# EAGLE design ultrasonic_send (EAGLE 6.5.0)
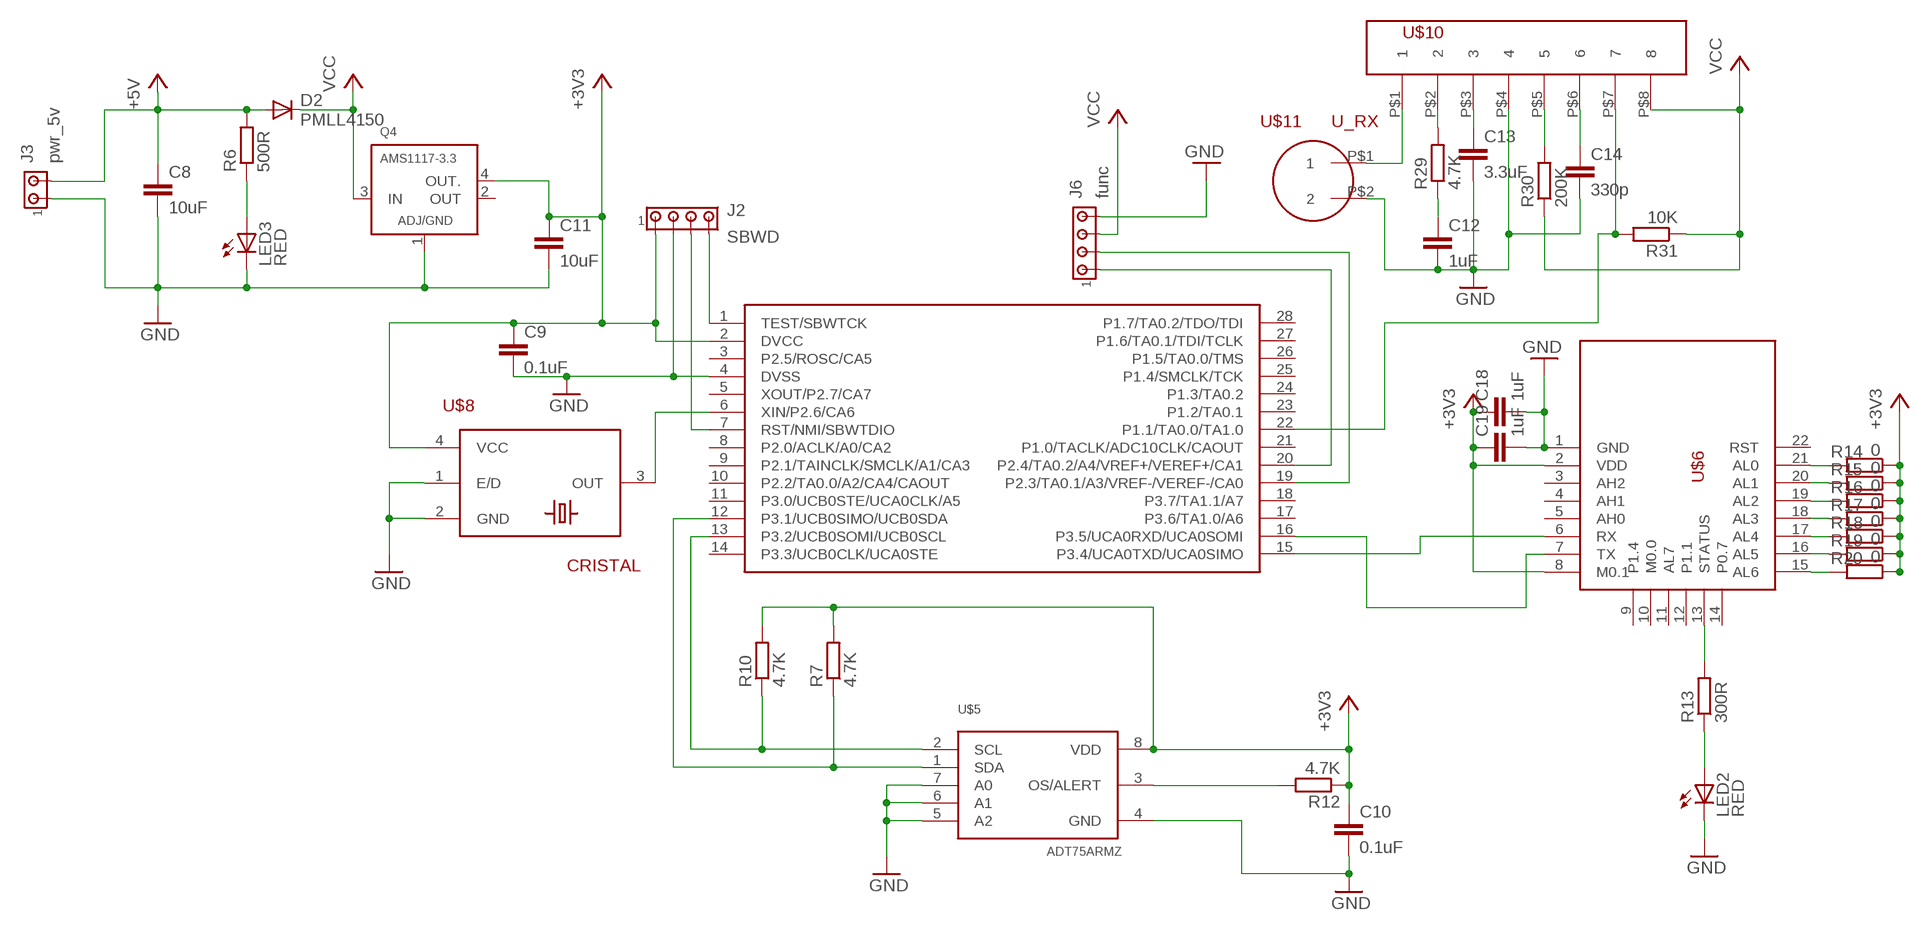
[diagram p0: schematic, sheet 1]

## Parts
C8  10uF  C-EUC0805  [C0805]
C9  0.1uF  C-EUC0805  [C0805]
C10  0.1uF  C-EUC0805  [C0805]
C11  10uF  C-EUC0805  [C0805]
C12  1uF  C-EUC0805  [C0805]
C13  3.3uF  C-EUC0805  [C0805]
C14  330p  C-EUC0805  [C0805]
C18  1uF  C-EUC0805  [C0805]
C19  1uF  C-EUC0805  [C0805]
D2  PMLL4150  [SOD80C]
J2  SBWD  MTA04-100  [10X04MTA]
J3  pwr_5v  MTA02-100  [10X02MTA]
J6  func  MTA04-100  [10X04MTA]
LED2  RED  LEDCHIP-LED0805  [CHIP-LED0805]
LED3  RED  LEDCHIP-LED0805  [CHIP-LED0805]
Q4  AMS1117-3.3  TLV1117  [SOT223-4]
R6  500R  R-EU_R0603  [R0603]
R7  4.7K  R-EU_R0603  [R0603]
R10  4.7K  R-EU_R0603  [R0603]
R12  4.7K  R-EU_R0603  [R0603]
R13  300R  R-EU_R0603  [R0603]
R14  0  R-EU_R0603  [R0603]
R15  0  R-EU_R0603  [R0603]
R16  0  R-EU_R0603  [R0603]
R17  0  R-EU_R0603  [R0603]
R18  0  R-EU_R0603  [R0603]
R19  0  R-EU_R0603  [R0603]
R20  0  R-EU_R0603  [R0603]
R29  4.7K  R-EU_R0603  [R0603]
R30  200K  R-EU_R0603  [R0603]
R31  10K  R-EU_R0603  [R0603]
U$4  MSP430F2112  [PW_R-PDSO-G28]
U$5  ADT75ARMZ  [MSOP08]
U$6  ZIGBEE  [ZIGBEE]
U$8  CRISTAL  [CTS406]
U$10  CX20106  [CX20106]
U$11  U_RX  ULTRASONIC  [ULTRASONIC]

## Nets
+3V3: C9.1 C10.1 C11.1 C18.1 C19.1 J2.1 Q4.4(OUT.) R7.2 R10.2 R12.1 R14.1 R15.1 R16.1 R17.1 R18.1 R19.1 R20.1 U$4.2(DVCC) U$5.8(VDD) U$6.2(VDD) U$6.8(M0.1) U$8.4(VCC)
+5V: C8.1 D2.A J3.2 R6.2
GND: C8.2 C9.2 C10.2 C11.2 C12.2 C13.2 C14.2 C18.2 C19.2 J2.2 J3.1 J6.4 LED2.C LED3.C Q4.1(ADJ/GND) U$4.4(DVSS) U$5.4(GND) U$5.5(A2) U$5.6(A1) U$5.7(A0) U$6.1(GND) U$8.1(E/D) U$8.2(GND) U$10.P$4 U$11.P$2
N$11: J2.4 U$4.1(TEST/SBWTCK)
N$12: J2.3 U$4.7(RST/NMI/SBWTDIO)
N$13: LED3.A R6.1
N$14: R12.2 U$5.3(OS/ALERT)
N$15: R7.1 U$4.12(P3.1/UCB0SIMO/UCB0SDA) U$5.1(SDA)
N$16: R10.1 U$4.13(P3.2/UCB0SOMI/UCB0SCL) U$5.2(SCL)
N$17: U$4.6(XIN/P2.6/CA6) U$8.3(OUT)
N$19: U$4.16(P3.5/UCA0RXD/UCA0SOMI) U$6.7(TX)
N$20: U$4.15(P3.4/UCA0TXD/UCA0SIMO) U$6.6(RX)
N$21: LED2.A R13.1
N$22: R13.2 U$6.13(STATUS)
N$23: R14.2 U$6.21(AL0)
N$24: R15.2 U$6.20(AL1)
N$25: R16.2 U$6.19(AL2)
N$26: R17.2 U$6.18(AL3)
N$27: R18.2 U$6.17(AL4)
N$28: R19.2 U$6.16(AL5)
N$29: R20.2 U$6.15(AL6)
N$47: R29.2 U$10.P$2
N$48: C12.1 R29.1
N$49: U$10.P$1 U$11.P$1
N$50: C13.1 U$10.P$3
N$51: R31.2 U$4.22(P1.1/TA0.0/TA1.0) U$10.P$7
N$52: R30.2 U$10.P$5
N$53: C14.1 U$10.P$6
N$57: J6.1 U$4.20(P2.4/TA0.2/A4/VREF+/VEREF+/CA1)
N$58: J6.2 U$4.19(P2.3/TA0.1/A3/VREF-/VEREF-/CA0)
VCC: D2.C J6.3 Q4.3(IN) R30.1 R31.1 U$10.P$8
Unconnected: U$4.3(P2.5/ROSC/CA5) U$4.5(XOUT/P2.7/CA7) U$4.8(P2.0/ACLK/A0/CA2) U$4.9(P2.1/TAINCLK/SMCLK/A1/CA3) U$4.10(P2.2/TA0.0/A2/CA4/CAOUT) U$4.11(P3.0/UCB0STE/UCA0CLK/A5) U$4.14(P3.3/UCB0CLK/UCA0STE) U$4.17(P3.6/TA1.0/A6) U$4.18(P3.7/TA1.1/A7) U$4.21(P1.0/TACLK/ADC10CLK/CAOUT) U$4.23(P1.2/TA0.1) U$4.24(P1.3/TA0.2) U$4.25(P1.4/SMCLK/TCK) U$4.26(P1.5/TA0.0/TMS) U$4.27(P1.6/TA0.1/TDI/TCLK) U$4.28(P1.7/TA0.2/TDO/TDI) U$6.3(AH2) U$6.4(AH1) U$6.5(AH0) U$6.9(P1.4) U$6.10(M0.0) U$6.11(AL7) U$6.12(P1.1) U$6.14(P0.7) U$6.22(RST)

## Power pins joined to a net without a drawn wire
OUT: Q4.2(OUT)

## Library data of the parts
C8-C14 C18 C19 = resistor:C-EU: CAPACITOR, European symbol
D2 = diode:PMLL4150: DIODE high speed
J2 J6 = con-amp:MTA04-100: AMP connector
J3 = con-amp:MTA02-100: AMP connector
LED2 LED3 = led:LED: LED OSRAM: - CHIPLED LG R971, LG N971, LY N971, LG Q971, LY Q971, LO R971, LY R971 LH N974, LH R974 LS Q976, LO Q976, LY Q976 LO Q996 - Hyper CHIPLED LW Q18S LB Q993, LB Q99A, LB R99A - SideLED LS A670, LO A670, LY A670, LG A670, LP A670 LB A673, LV A673, LT A673, LW A673 LH A674 LY A675 LS A676, LA A676, LO A676, LY A676, LW A676 LS A679, LY A679, LG A679 - Hyper Micro SIDELED® LS Y876, LA Y876, LO Y876, LY Y876 LT Y87S - SmartLED LW L88C, LW L88S LB L89C, LB L89S, LG L890 LS L89K, LO L89K, LY L89K LS L896, LA L896, LO L896, LY L896 - TOPLED LS T670, LO T670, LY T670, LG T670, LP T670 LSG T670, LSP T670, LSY T670, LOP T670, LYG T670 LG T671, LOG T671, LSG T671 LB T673, LV T673, LT T673, LW T673 LH T674 LS T676, LA T676, LO T676, LY T676, LB T676, LH T676, LSB T676, LW T676 LB T67C, LV T67C, LT T67C, LS T67K, LO T67K, LY T67K, LW E67C LS E67B, LA E67B, LO E67B, LY E67B, LB E67C, LV E67C, LT E67C LW T67C LS T679, LY T679, LG T679 LS T770, LO T770, LY T770, LG T770, LP T770 LB T773, LV T773, LT T773, LW T773 LH T774 LS E675, LA E675, LY E675, LS T675 LS T776, LA T776, LO T776, LY T776, LB T776 LHGB T686 LT T68C, LB T68C - Hyper Mini TOPLED® LB M676 - Mini TOPLED Santana® LG M470 LS M47K, LO M47K, LY M47K Source: http://www.osram.convergy.de LUXEON: - LUMILED® LXK2-PW12-R00, LXK2-PW12-S00, LXK2-PW14-U00, LXK2-PW14-V00 LXK2-PM12-R00, LXK2-PM12-S00, LXK2-PM14-U00 LXK2-PE12-Q00, LXK2-PE12-R00, LXK2-PE12-S00, LXK2-PE14-T00, LXK2-PE14-U00 LXK2-PB12-K00, LXK2-PB12-L00, LXK2-PB12-M00, LXK2-PB14-N00, LXK2-PB14-P00, LXK2-PB14-Q00 LXK2-PR12-L00, LXK2-PR12-M00, LXK2-PR14-Q00, LXK2-PR14-R00 LXK2-PD12-Q00, LXK2-PD12-R00, LXK2-PD12-S00 LXK2-PH12-R00, LXK2-PH12-S00 LXK2-PL12-P00, LXK2-PL12-Q00, LXK2-PL12-R00 Source: www.luxeon.com KINGBRIGHT: KA-3528ASYC Source: www.kingbright.com
Q4 = ti-parts:TLV1117: LDO VOLTAGE REGULATOR
R6 R7 R10 R12-R20 R29-R31 = resistor:R-EU_: RESISTOR, European symbol
U$4 = tofu:MSP430F2112
U$5 = tofu:ADT75ARMZ: ±1°C Accurate, 12-Bit Digital Temperature Sensor
U$6 = tofu:ZIGBEE
U$8 = tofu:CRISTAL
U$10 = tofu:CX20106
U$11 = tofu:ULTRASONIC

## Board
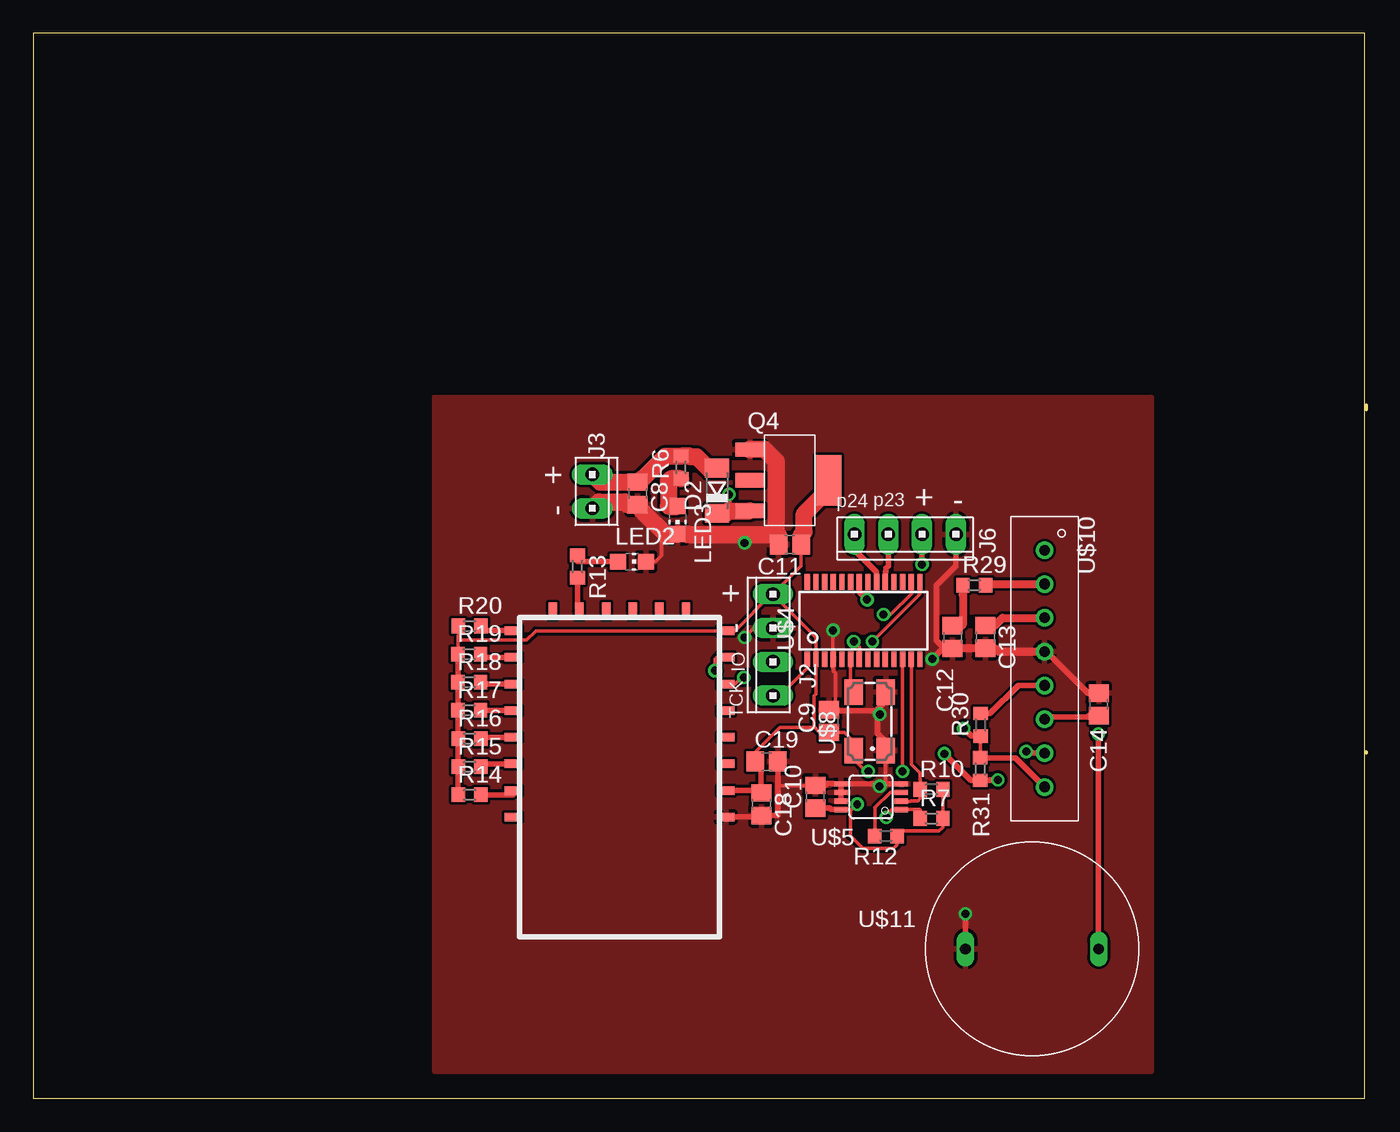
[diagram p1: board, top side]
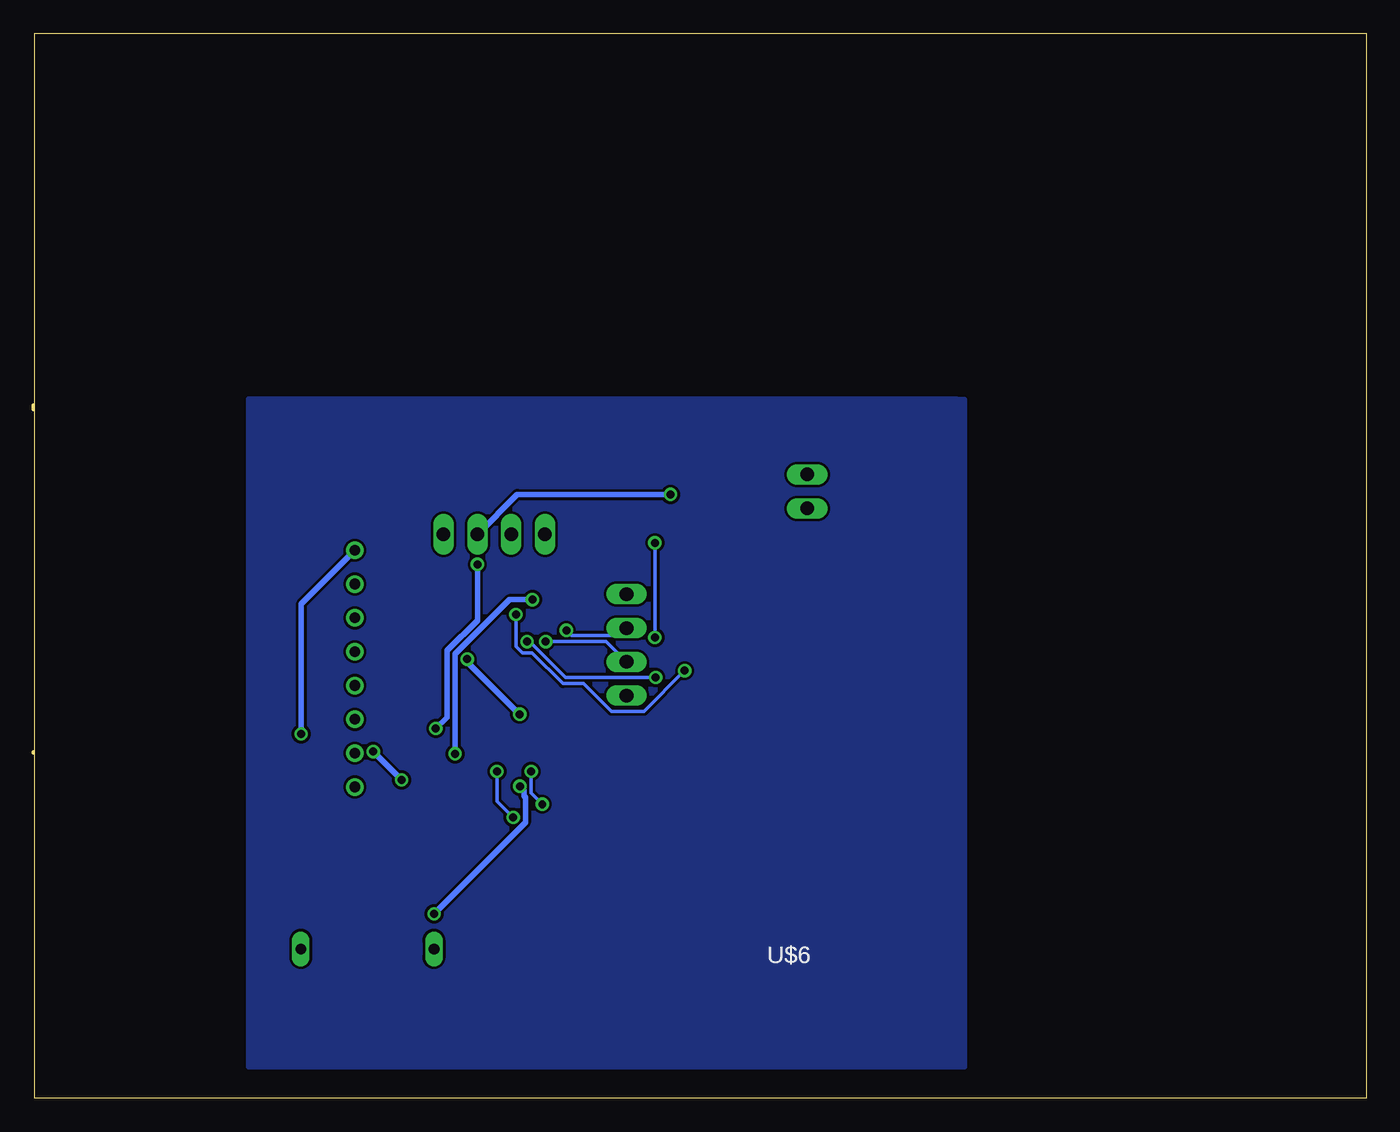
[diagram p2: board, bottom side, seen from below]

Size 100.1 x 80 mm. Coordinates in mm from the lower left corner, seen from the top.
Outline: 100.1,26.04 100.1,25.93
Outline: 100.1,51.74 100.1,52.07
Outline: 0,0 100,0 100,80 0,80 0,0
Copper layers (1*16): Top 0.035mm / dielectric 1.5mm / Bottom 0.035mm
Design rules "default *": minimum track width 10mil, minimum drill 10mil, track to track 8mil, track to pad 8mil, pad to pad 8mil, via to via 8mil, smd to smd 8mil, copper to edge 40mil, drill to drill 8mil, minimum pad ring 10mil, minimum via ring 8mil, stop-mask expansion 4mil, vias tented up to drill 0.7mm, thermal gap 10mil

### Footprints (pad centres in the part's own frame; a part is rotated, then mirrored left to right if it is on the bottom)
C0805 = smd 1.3 x 1.5: 1 -0.85,0; 2 0.85,0
SOD80C = smd 1.4 x 1.8: A 1.7,0; C -1.7,0
10X04MTA = drill 1.016 long: 1 3.81,0; 2 1.27,0; 3 -1.27,0; 4 -3.81,0
10X02MTA = drill 1.016 long: 1 1.27,0; 2 -1.27,0
CHIP-LED0805 = smd 1.2 x 1.2: A 0,-1.05; C 0,1.05
SOT223-4 = smd 1.067 x 2.184: 1 -2.3,-3; 2 0,-3; 3 2.3,-3 | smd 3.81 x 1.93: 4 0,2.9
R0603 = smd 1 x 1.1: 1 -0.85,0; 2 0.85,0
PW_R-PDSO-G28 = smd 0.4 x 1.2: 1 -4.225,-2.9; 2 -3.575,-2.9; 3 -2.925,-2.9; 4 -2.275,-2.9; 5 -1.625,-2.9; 6 -0.975,-2.9; 7 -0.325,-2.9; 8 0.325,-2.9; 9 0.975,-2.9; 10 1.625,-2.9; 11 2.275,-2.9; 12 2.925,-2.9; 13 3.575,-2.9; 14 4.225,-2.9; 15 4.225,2.9; 16 3.575,2.9; 17 2.925,2.9; 18 2.275,2.9; 19 1.625,2.9; 20 0.975,2.9; 21 0.325,2.9; 22 -0.325,2.9; 23 -0.975,2.9; 24 -1.625,2.9; 25 -2.275,2.9; 26 -2.925,2.9; 27 -3.575,2.9; 28 -4.225,2.9
MSOP08 = smd 0.4 x 1: 1 -0.976,-2.263; 2 -0.326,-2.263; 3 0.324,-2.263; 4 0.974,-2.263; 5 0.974,2.262; 6 0.324,2.262; 7 -0.326,2.262; 8 -0.976,2.262
ZIGBEE = smd 0.635 x 1.27: 1 3,8; 2 1,8; 3 -1,8; 4 -3,8; 5 -5,8; 6 -7,8; 7 -9,8; 8 -11,8; 15 -11,-8; 16 -9,-8; 17 -7,-8; 18 -5,-8; 19 -3,-8; 20 -1,-8; 21 1,-8; 22 3,-8 | smd 1.27 x 0.635: 9 -12.5,5; 10 -12.5,3; 11 -12.5,1; 12 -12.5,-1; 13 -12.5,-3; 14 -12.5,-5
CTS406 = smd 1.9 x 1.4: 1 -2.2,-1.2; 2 2.2,-1.2; 3 2.2,1.2; 4 -2.2,1.2
CX20106 = drill 0.8: P$1 -10.16,0; P$2 -7.62,0; P$3 -5.08,0; P$4 -2.54,0; P$5 0,0; P$6 2.54,0; P$7 5.08,0; P$8 7.62,0
ULTRASONIC = drill 0.8 long: P$1 -5,0; P$2 5,0

### Placement (x,y rotation side)
C8  45.39,45.44 270 top
C9  59.77,28.35 90 top
C10  58.72,22.66 90 top
C11  56.82,41.61 180 top
C12  69.04,34.65 270 top
C13  71.5,34.67 270 top
C14  80.01,29.59 90 top
C18  54.69,22.1 270 top
C19  55.07,25.3 0 top
D2  51.33,45.64 90 top
J2  55.55,34.06 90 top
J3  41.99,45.59 270 top
J6  65.48,42.37 180 top
LED2  44.96,40.31 270 top
LED3  48.39,43.43 180 top
Q4  56.82,46.43 270 top
R6  48.64,47.4 90 top
R7  67.46,21.03 0 top
R10  67.46,23.22 0 top
R12  64.03,19.71 180 top
R13  40.87,39.95 270 top
R14  32.77,22.81 0 top
R15  32.77,24.92 0 top
R16  32.77,27.03 0 top
R17  32.74,29.16 0 top
R18  32.74,31.27 0 top
R19  32.74,33.38 0 top
R20  32.77,35.48 0 top
R29  70.66,38.56 0 top
R30  71.15,28.07 90 top
R31  71.12,24.74 270 top
U$4  62.36,35.89 0 top
U$5  62.92,22.66 90 top
U$6  44.02,24.13 270 top
U$8  62.81,28.32 90 top
U$10  75.95,31.01 270 top
U$11  75.01,11.23 180 top

### Tracks (layer width: path | path; a pad name or v marks a point on that pad's centre or on a via)
+3V3  (via drill 0.6)
  Top 0.254: 58.62,27.94 58.62,30.23 58.78,30.38 58.78,32.97 U$4.2 58.78,33.12 58.78,34.62 55.63,37.77 J2.1 | 58.62,27.94 59.05,27.51 59.66,27.51 C9.1 59.89,27.51 60.48,27.51 60.5,27.48 60.91,27.48 61.62,26.77 61.62,26.14 U$8.4 61.62,26.01 61.62,25.48 62.53,24.56 v62.71,24.56 | R10.2 68.3,21.13 R7.2 68.3,20.37 68.02,20.09 64.87,20.09 R12.1 64.87,19.61 64.87,19.05 64.59,18.77 62.31,18.77 61.37,19.71 61.37,21.67 | 58.62,27.94 58.52,27.86 56.08,27.86 54.23,26.01 54.23,25.48 C19.1 | 61.37,21.67 61.34,21.69 60.83,21.69 U$5.8 | v61.87,22.1 61.47,21.69 61.37,21.67 | 31.9,34.42 31.9,34.75 31.93,34.77 R20.1 | 31.9,34.42 31.9,33.55 R19.1 | 31.9,34.42 37.03,34.42 37.74,35.13 51.99,35.13 U$6.8 52.12,35.13 52.7,35.13 55.45,37.87 J2.1 | C11.1 57.66,41 57.66,40.01 55.63,37.97 J2.1
  Top 0.406: R19.1 R18.1 R17.1 31.89,27.03 R16.1 R15.1 R14.1 | C18.1 54.69,23.11 54.63,23.11 54.63,23.13 | 54.63,23.13 U$6.2 | 54.63,23.13 54.63,25.3 C19.1 | C10.1 59.78,21.81 59.89,21.69 60.64,21.69 U$5.8
  Top 1.27: C11.1 57.66,41.6 57.66,42.32 57.89,42.55 57.89,43.89 59.72,45.72 Q4.4
  Bottom 0.254: v62.71,24.56 62.71,22.94 v61.87,22.1
+5V
  Top 1.27: J3.2 42.57,46.28 C8.1 45.9,46.66 47.47,48.23 48.64,48.23 | 48.64,48.23 R6.2 | D2.A 50.67,47.35 49.81,48.21 49.38,48.21 49.35,48.23 48.64,48.23
GND  (via drill 0.6)
  Top 0.254: C9.2 59.77,29.18 60.22,29.18 60.22,31.95 60.1,32.08 60.1,32.26 60.07,32.28 60.07,32.97 U$4.4 60.07,33.1 v60.07,35.15 | 63.98,23.63 63.98,25.4 64.01,25.43 64.01,26.01 U$8.1 | 55.92,23.47 57.99,23.47 58.01,23.5 58.55,23.5 C10.2 | J2.2 54.13,35.33 v53.42,34.62 | v53.42,41.73 53.42,42.34 | LED2.C 46.71,40.31 47.17,40.77 47.17,41.83 47.47,42.39
  Top 0.406: C19.2 55.92,23.47 55.92,21.25 C18.2 54.69,21.13 U$6.1 | U$5.5 60.63,23.62 60.07,23.62 60.05,23.65 59.59,23.65 59.44,23.5 58.73,23.5 C10.2 | U$5.5 U$5.6 U$5.7 | U$5.5 63.55,23.63 | 63.55,23.63 63.98,23.63 U$5.4 | 63.3,29.11 64.01,29.82 64.01,30.48 63.93,30.56 63.93,31.06 63.98,31.11 64.01,31.11 U$8.2 | 63.3,29.11 60.48,29.11 60.4,29.18 60.33,29.18 C9.2 | 63.4,28.85 63.4,27.43 64.01,26.82 64.01,26.24 U$8.1 | 63.4,28.85 63.4,28.93 63.3,29.11 | 68.33,33.81 68.76,33.81 C12.2 | v67.51,32.99 68.33,33.81 | v63.58,28.85 63.4,28.85 | J6.4 69.29,40.01 67.82,38.53 67.82,34.39 68.22,33.98 68.33,33.81 | C14.2 80.01,30.43 79.22,30.43 76.22,33.43 U$10.P$4 | v70,13.87 U$11.P$2 | v63.55,23.44 63.55,23.63
  Top 0.61: C12.2 69.75,33.81 69.77,33.83 71.5,33.83 C13.2 71.78,33.83 72.21,33.83 72.49,33.55 U$10.P$4
  Top 1.27: J3.1 42.47,44.81 44.45,44.81 44.65,44.6 45.39,44.6 C8.2 45.77,44.09 47.47,42.39 48.39,42.39 | 48.39,42.39 LED3.C | 55.8,42.34 53.42,42.34 49.15,42.34 49.1,42.39 48.39,42.39 | 55.8,42.34 55.91,42.34 55.98,42.27 55.98,41.6 C11.2 | 55.8,42.34 55.8,47.85 54.91,48.74 53.82,48.74 Q4.1
  Bottom 0.254: v53.42,41.73 v53.42,34.62 | v60.07,35.15 59.69,34.77 56.11,34.77 J2.2
  Bottom 0.406: v67.51,32.99 67.51,32.79 v63.58,28.85 | v70,13.87 63.14,20.73 63.14,22.61 63.25,22.71 63.25,23.14 v63.55,23.44
  pour Top: 30.2,52.65 83.95,52.65 83.95,2.06 30.15,2.06 30.15,52.68
N$1
  pour Bottom: 30.76,52.53 83.92,52.53 83.92,2.39 30.18,2.39 30.18,52.5
N$11
  Top 0.254: J2.4 56.06,30.25 58.14,32.33 58.14,32.97 U$4.1
N$12  (via drill 0.6)
  Top 0.254: v61.62,34.31 62.03,33.91 U$4.7
  Bottom 0.254: v61.62,34.31 57.07,34.31 J2.3
N$13
  Top 1.27: LED3.A 47.73,44.48 47.7,44.5 47.7,46.35 47.9,46.56 R6.1
N$14
  Top 0.254: U$5.3 64.36,22.99 63.22,21.84 63.22,20.45 63.2,20.42 63.2,19.71 R12.2
N$15  (via drill 0.6)
  Top 0.254: R7.1 66.62,21.03 66.62,21.67 66.6,21.69 65.2,21.69 U$5.1 65.05,21.69 64.49,21.69 64.06,21.26 v64.06,21.11 | v65.28,24.56 65.28,32.97 U$4.12
  Bottom 0.254: v65.28,24.56 65.28,22.33 v64.06,21.11
N$16
  Top 0.254: U$5.2 65.2,22.33 65.89,22.33 65.91,22.35 66.42,22.35 66.62,22.55 66.62,23.22 R10.1 66.62,23.32 66.62,23.93 66.6,23.95 66.6,24.43 65.94,25.09 65.94,32.97 U$4.13
N$17
  Top 0.254: U$4.6 61.38,30.75 U$8.3
N$19  (via drill 0.6)
  Top 0.254: v63.86,36.35 64.39,36.35 65.94,37.9 U$4.16 | v51.18,32.13 51.18,32.99 51.31,33.12 51.99,33.12 U$6.7
  Bottom 0.254: v63.86,36.35 63.86,33.96 63.37,33.48 62.64,33.48 60.33,31.17 58.78,31.17 56.69,29.08 54.23,29.08 v51.18,32.13
N$20  (via drill 0.6)
  Top 0.254: v63.02,34.31 66.57,37.87 U$4.15 | v53.37,31.62 53.19,31.62 52.7,31.14 U$6.6
  Bottom 0.254: v63.02,34.31 62.81,34.31 60.12,31.62 v53.37,31.62
N$21
  Top 0.406: R13.1 40.87,40.31 LED2.A
N$22
  Top 0.406: R13.2 40.87,36.63 U$6.13
N$23
  Top 0.406: U$6.21 36.02,22.81 R14.2
N$24
  Top 0.406: R15.2 33.62,25.13 U$6.20
N$25
  Top 0.406: R16.2 33.62,27.13 U$6.19
N$26
  Top 0.406: R17.2 33.59,29.13 U$6.18
N$27
  Top 0.406: R18.2 33.59,31.13 U$6.17
N$28
  Top 0.406: R19.2 33.59,33.13 U$6.16
N$29
  Top 0.406: R20.2 33.62,35.13 U$6.15
N$47
  Top 0.61: U$10.P$2 71.5,38.63 R29.2
N$48
  Top 0.61: C12.1 69.04,35.48 69.7,35.48 69.8,35.59 69.8,37.82 69.83,37.85 69.83,38.56 R29.1
N$49  (via drill 0.6)
  Top 0.406: v79.98,27.38 79.98,11.23 U$11.P$1
  Bottom 0.406: v79.98,27.38 79.98,37.13 U$10.P$1
N$50
  Top 0.61: U$10.P$3 72.8,36.09 72.21,35.51 C13.1
N$51  (via drill 0.6)
  Top 0.406: v68.43,25.88 70.41,23.9 R31.2 71.3,23.9 71.83,23.9 71.86,23.93 v72.44,23.93 | v62.61,37.47 62.05,38.02 62.05,38.46 62.03,38.48 U$4.22 | U$10.P$7 74.7,25.93 v74.57,26.06
  Bottom 0.406: v68.43,25.88 68.43,33.38 64.34,37.47 v62.61,37.47 | v72.44,23.93 v74.57,26.06
N$52
  Top 0.406: U$10.P$5 73.97,31.01 71.86,28.91 71.14,28.91 R30.2
N$53
  Top 0.406: U$10.P$6 76.33,28.65 79.2,28.65 79.3,28.75 80.01,28.75 C14.1
  Top 0.813: 75.92,28.5 U$10.P$6
N$57
  Top 0.406: J6.1 61.67,41.2 63.32,39.55 63.32,38.81 U$4.20
N$58
  Top 0.406: J6.2 64.21,40.01 64.03,39.83 64.03,39.57 64.01,39.55 64.01,39.45 63.98,39.42 63.98,38.81 U$4.19
VCC  (via drill 0.6)
  Top 0.254: 71.12,25.4 R31.1 71.12,26.67 69.85,27.94 v69.88,27.79
  Top 0.406: v52.25,45.36 52.25,44.73 52.22,44.12 | v66.75,40.11 J6.3 | v69.88,27.79 70.43,27.23 R30.1 | U$10.P$8 73.76,25.58 71.12,25.58 R31.1
  Top 1.27: Q4.3 53.8,44.12 52.22,44.12 52.05,43.94 D2.C
  Bottom 0.406: v52.25,45.36 63.75,45.36 J6.3 | v66.75,40.11 66.75,35.92 69.04,33.63 69.04,28.63 v69.88,27.79

### Text on the board
tNames: + | p24 | p23 | - | + | - | + | - | IO | TCK
_tNames: J3 | Q4 | R6 | C8 | LED3 | D2 | U$10 | J6 | LED2 | R13 | C11 | R29 | R20 | C13 | R19 | U$4 | R18 | C12 | J2 | R17 | R16 | C9 | R30 | R15 | C19 | U$8 | C14 | R14 | R10 | C18 | R31 | C10 | R7 | U$5 | R12 | U$11
_bNames: U$6